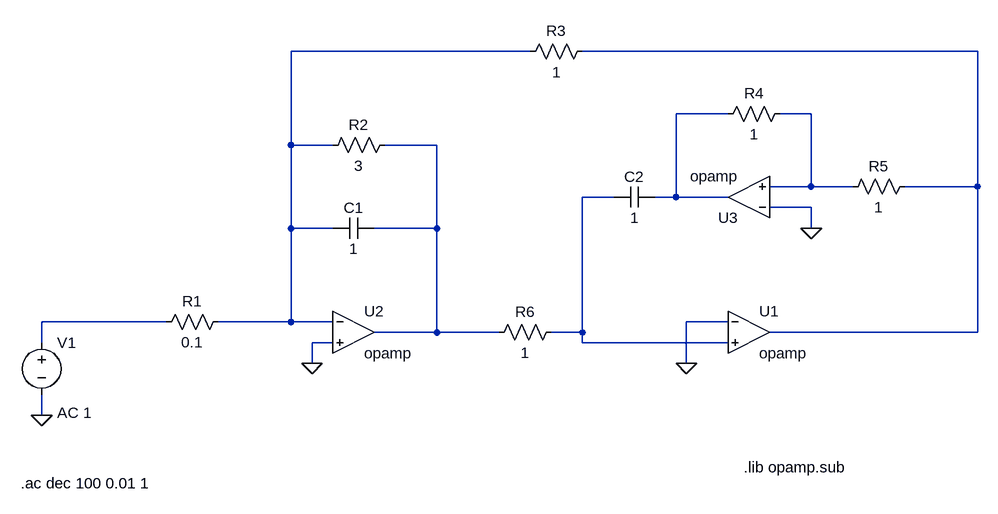
[diagram p0: schematic tp2.asc]
tp2.asc, the LTspice schematic file:
Version 4
SHEET 1 880 680
WIRE -112 -160 -480 -160
WIRE 576 -160 -32 -160
WIRE 192 -64 112 -64
WIRE 320 -64 272 -64
WIRE -480 -16 -480 -160
WIRE -416 -16 -480 -16
WIRE -256 -16 -336 -16
WIRE 320 48 320 -64
WIRE 320 48 256 48
WIRE 384 48 320 48
WIRE 576 48 576 -160
WIRE 576 48 464 48
WIRE 16 64 -32 64
WIRE 112 64 112 -64
WIRE 112 64 80 64
WIRE 192 64 112 64
WIRE 320 80 256 80
WIRE -480 112 -480 -16
WIRE -416 112 -480 112
WIRE -256 112 -256 -16
WIRE -256 112 -352 112
WIRE 320 112 320 80
WIRE -672 256 -864 256
WIRE -480 256 -480 112
WIRE -480 256 -592 256
WIRE -416 256 -480 256
WIRE 192 256 128 256
WIRE -256 272 -256 112
WIRE -256 272 -352 272
WIRE -160 272 -256 272
WIRE -32 272 -32 64
WIRE -32 272 -80 272
WIRE 576 272 576 48
WIRE 576 272 256 272
WIRE -864 288 -864 256
WIRE -416 288 -448 288
WIRE -32 288 -32 272
WIRE 192 288 -32 288
WIRE -448 320 -448 288
WIRE 128 320 128 256
WIRE -864 400 -864 368
FLAG -448 320 0
FLAG 128 320 0
FLAG 320 112 0
FLAG -864 400 0
SYMBOL Opamps\\opamp 224 208 R0
SYMATTR InstName U1
SYMBOL Opamps\\opamp -384 208 R0
SYMATTR InstName U2
SYMBOL Opamps\\opamp 224 128 R180
SYMATTR InstName U3
SYMBOL res -576 240 R90
WINDOW 0 0 56 VBottom 2
WINDOW 3 32 56 VTop 2
SYMATTR InstName R1
SYMATTR Value 0.1
SYMBOL res -320 -32 R90
WINDOW 0 0 56 VBottom 2
WINDOW 3 32 56 VTop 2
SYMATTR InstName R2
SYMATTR Value 3
SYMBOL res -16 -176 R90
WINDOW 0 0 56 VBottom 2
WINDOW 3 32 56 VTop 2
SYMATTR InstName R3
SYMATTR Value 1
SYMBOL res 288 -80 R90
WINDOW 0 0 56 VBottom 2
WINDOW 3 32 56 VTop 2
SYMATTR InstName R4
SYMATTR Value 1
SYMBOL res 480 32 R90
WINDOW 0 0 56 VBottom 2
WINDOW 3 32 56 VTop 2
SYMATTR InstName R5
SYMATTR Value 1
SYMBOL res -64 256 R90
WINDOW 0 0 56 VBottom 2
WINDOW 3 32 56 VTop 2
SYMATTR InstName R6
SYMATTR Value 1
SYMBOL cap -352 96 R90
WINDOW 0 0 32 VBottom 2
WINDOW 3 32 32 VTop 2
SYMATTR InstName C1
SYMATTR Value 1
SYMBOL cap 80 48 R90
WINDOW 0 0 32 VBottom 2
WINDOW 3 32 32 VTop 2
SYMATTR InstName C2
SYMATTR Value 1
SYMBOL voltage -864 272 R0
WINDOW 123 24 124 Left 2
WINDOW 39 0 0 Left 2
SYMATTR Value2 AC 1
SYMATTR InstName V1
SYMATTR Value ""
TEXT 216 480 Left 2 !.lib opamp.sub
TEXT -896 504 Left 2 !.ac dec 100 0.01 1

The netlist it stands for:
* tp2.asc
XU1 0 N006 N002 opamp Aol=100K GBW=10Meg  ; pins invin noninvin out
XU2 N001 0 N005 opamp Aol=100K GBW=10Meg  ; pins invin noninvin out
XU3 0 N004 N003 opamp Aol=100K GBW=10Meg  ; pins invin noninvin out
R1 N001 N007 0.1
R2 N005 N001 3
R3 N002 N001 1
R4 N004 N003 1
R5 N002 N004 1
R6 N006 N005 1
C1 N005 N001 1
C2 N003 N006 1
V1 N007 0 AC 1
.lib opamp.sub
.ac dec 100 0.01 1
.backanno
.end